# EAGLE schematic board (EAGLE 8.5.1)
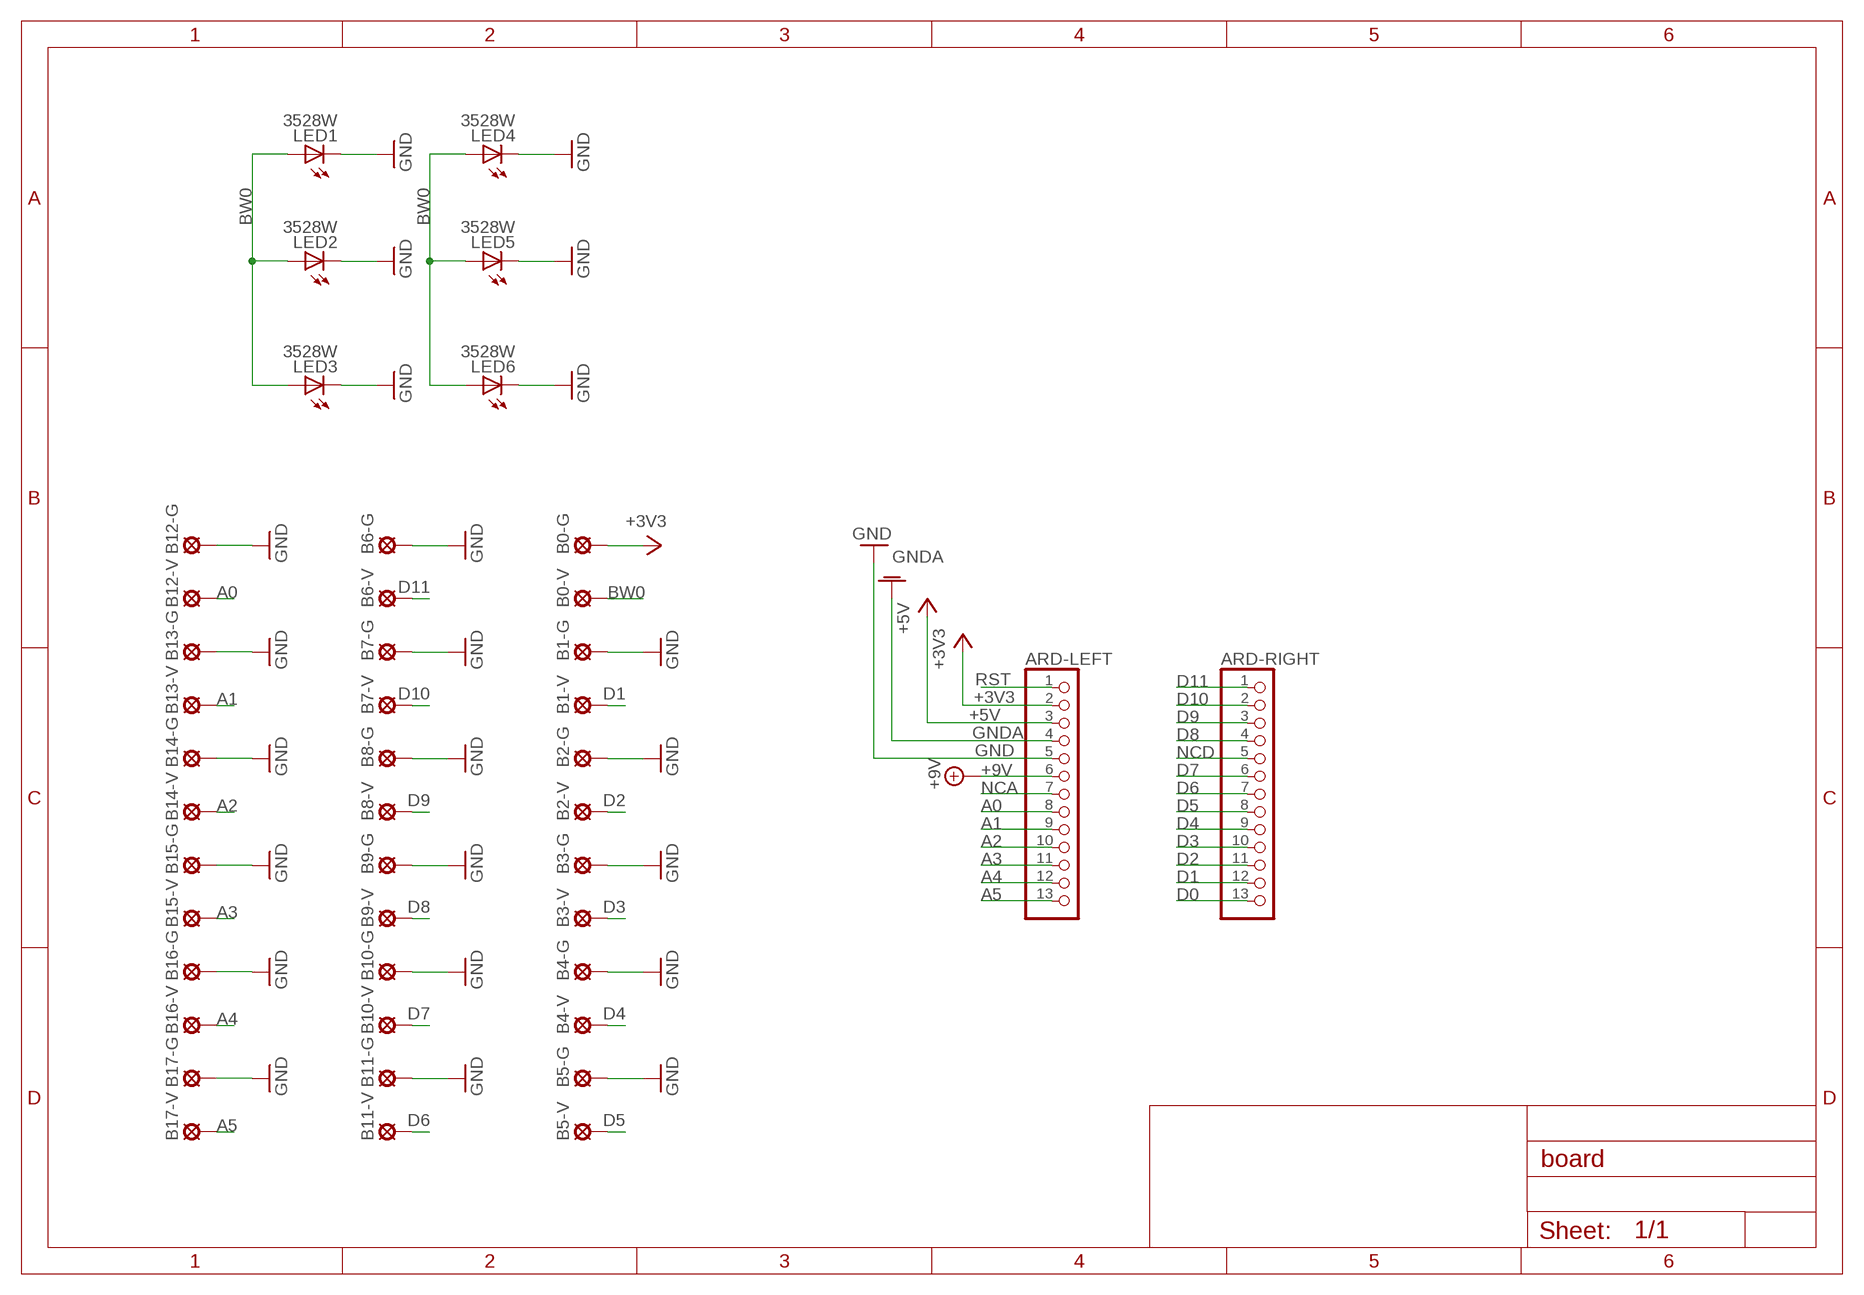
[diagram p0: schematic, sheet 1]

## Parts
ARD-LEFT  PINHD-1X13  [1X13]
ARD-RIGHT  PINHD-1X13  [1X13]
B0-G  LSP10  [LSP10]
B0-V  LSP10  [LSP10]
B1-G  LSP10  [LSP10]
B1-V  LSP10  [LSP10]
B2-G  LSP10  [LSP10]
B2-V  LSP10  [LSP10]
B3-G  LSP10  [LSP10]
B3-V  LSP10  [LSP10]
B4-G  LSP10  [LSP10]
B4-V  LSP10  [LSP10]
B5-G  LSP10  [LSP10]
B5-V  LSP10  [LSP10]
B6-G  LSP10  [LSP10]
B6-V  LSP10  [LSP10]
B7-G  LSP10  [LSP10]
B7-V  LSP10  [LSP10]
B8-G  LSP10  [LSP10]
B8-V  LSP10  [LSP10]
B9-G  LSP10  [LSP10]
B9-V  LSP10  [LSP10]
B10-G  LSP10  [LSP10]
B10-V  LSP10  [LSP10]
B11-G  LSP10  [LSP10]
B11-V  LSP10  [LSP10]
B12-G  LSP10  [LSP10]
B12-V  LSP10  [LSP10]
B13-G  LSP10  [LSP10]
B13-V  LSP10  [LSP10]
B14-G  LSP10  [LSP10]
B14-V  LSP10  [LSP10]
B15-G  LSP10  [LSP10]
B15-V  LSP10  [LSP10]
B16-G  LSP10  [LSP10]
B16-V  LSP10  [LSP10]
B17-G  LSP10  [LSP10]
B17-V  LSP10  [LSP10]
LED1  3528W  LEDP-LCC-2  [P-LCC-2]
LED2  3528W  LEDP-LCC-2  [P-LCC-2]
LED3  3528W  LEDP-LCC-2  [P-LCC-2]
LED4  3528W  LEDP-LCC-2  [P-LCC-2]
LED5  3528W  LEDP-LCC-2  [P-LCC-2]
LED6  3528W  LEDP-LCC-2  [P-LCC-2]

## Nets
+3V3: ARD-LEFT.2 B0-G.MP
+5V: ARD-LEFT.3
+9V: ARD-LEFT.6
A0: ARD-LEFT.8 B12-V.MP
A1: ARD-LEFT.9 B13-V.MP
A2: ARD-LEFT.10 B14-V.MP
A3: ARD-LEFT.11 B15-V.MP
A4: ARD-LEFT.12 B16-V.MP
A5: ARD-LEFT.13 B17-V.MP
BW0: B0-V.MP LED1.A LED2.A LED3.A LED4.A LED5.A LED6.A
D0: ARD-RIGHT.13
D1: ARD-RIGHT.12 B1-V.MP
D2: ARD-RIGHT.11 B2-V.MP
D3: ARD-RIGHT.10 B3-V.MP
D4: ARD-RIGHT.9 B4-V.MP
D5: ARD-RIGHT.8 B5-V.MP
D6: ARD-RIGHT.7 B11-V.MP
D7: ARD-RIGHT.6 B10-V.MP
D8: ARD-RIGHT.4 B9-V.MP
D9: ARD-RIGHT.3 B8-V.MP
D10: ARD-RIGHT.2 B7-V.MP
D11: ARD-RIGHT.1 B6-V.MP
GND: ARD-LEFT.5 B1-G.MP B2-G.MP B3-G.MP B4-G.MP B5-G.MP B6-G.MP B7-G.MP B8-G.MP B9-G.MP B10-G.MP B11-G.MP B12-G.MP B13-G.MP B14-G.MP B15-G.MP B16-G.MP B17-G.MP LED1.C LED2.C LED3.C LED4.C LED5.C LED6.C
GNDA: ARD-LEFT.4
NCA: ARD-LEFT.7
NCD: ARD-RIGHT.5
RST: ARD-LEFT.1

## Library data of the parts
ARD-LEFT ARD-RIGHT = pinhead:PINHD-1X13: PIN HEADER; OC_FARNELL: unknown
B0-G B0-V B1-G B1-V B2-G B2-V B3-G B3-V B4-G B4-V B5-G B5-V B6-G B6-V B7-G B7-V B8-G B8-V B9-G B9-V B10-G B10-V B11-G B11-V B12-G B12-V B13-G B13-V B14-G B14-V B15-G B15-V B16-G B16-V B17-G B17-V = solpad:LSP10: SOLDER PAD drill 1.0 mm, distributor Buerklin, 12H555; OC_FARNELL: unknown
LED1-LED6 = led:LED: LED OSRAM: - CHIPLED LG R971, LG N971, LY N971, LG Q971, LY Q971, LO R971, LY R971 LH N974, LH R974 LS Q976, LO Q976, LY Q976 LO Q996 - Hyper CHIPLED LW Q18S LB Q993, LB Q99A, LB R99A - SideLED LS A670, LO A670, LY A670, LG A670, LP A670 LB A673, LV A673, LT A673, LW A673 LH A674 LY A675 LS A676, LA A676, LO A676, LY A676, LW A676 LS A679, LY A679, LG A679 - Hyper Micro SIDELED® LS Y876, LA Y876, LO Y876, LY Y876 LT Y87S - SmartLED LW L88C, LW L88S LB L89C, LB L89S, LG L890 LS L89K, LO L89K, LY L89K LS L896, LA L896, LO L896, LY L896 - TOPLED LS T670, LO T670, LY T670, LG T670, LP T670 LSG T670, LSP T670, LSY T670, LOP T670, LYG T670 LG T671, LOG T671, LSG T671 LB T673, LV T673, LT T673, LW T673 LH T674 LS T676, LA T676, LO T676, LY T676, LB T676, LH T676, LSB T676, LW T676 LB T67C, LV T67C, LT T67C, LS T67K, LO T67K, LY T67K, LW E67C LS E67B, LA E67B, LO E67B, LY E67B, LB E67C, LV E67C, LT E67C LW T67C LS T679, LY T679, LG T679 LS T770, LO T770, LY T770, LG T770, LP T770 LB T773, LV T773, LT T773, LW T773 LH T774 LS E675, LA E675, LY E675, LS T675 LS T776, LA T776, LO T776, LY T776, LB T776 LHGB T686 LT T68C, LB T68C - Hyper Mini TOPLED® LB M676 - Mini TOPLED Santana® LG M470 LS M47K, LO M47K, LY M47K Source: http://www.osram.convergy.de LUXEON: - LUMILED® LXK2-PW12-R00, LXK2-PW12-S00, LXK2-PW14-U00, LXK2-PW14-V00 LXK2-PM12-R00, LXK2-PM12-S00, LXK2-PM14-U00 LXK2-PE12-Q00, LXK2-PE12-R00, LXK2-PE12-S00, LXK2-PE14-T00, LXK2-PE14-U00 LXK2-PB12-K00, LXK2-PB12-L00, LXK2-PB12-M00, LXK2-PB14-N00, LXK2-PB14-P00, LXK2-PB14-Q00 LXK2-PR12-L00, LXK2-PR12-M00, LXK2-PR14-Q00, LXK2-PR14-R00 LXK2-PD12-Q00, LXK2-PD12-R00, LXK2-PD12-S00 LXK2-PH12-R00, LXK2-PH12-S00 LXK2-PL12-P00, LXK2-PL12-Q00, LXK2-PL12-R00 Source: www.luxeon.com KINGBRIGHT: KA-3528ASYC Source: www.kingbright.com; OC_FARNELL: unknown

## Net classes
0 default: width 0.305 mm, drill 0.508 mm, clearance 0.508 mm